# Altium schematic sheet brushless.SchDoc
size A4
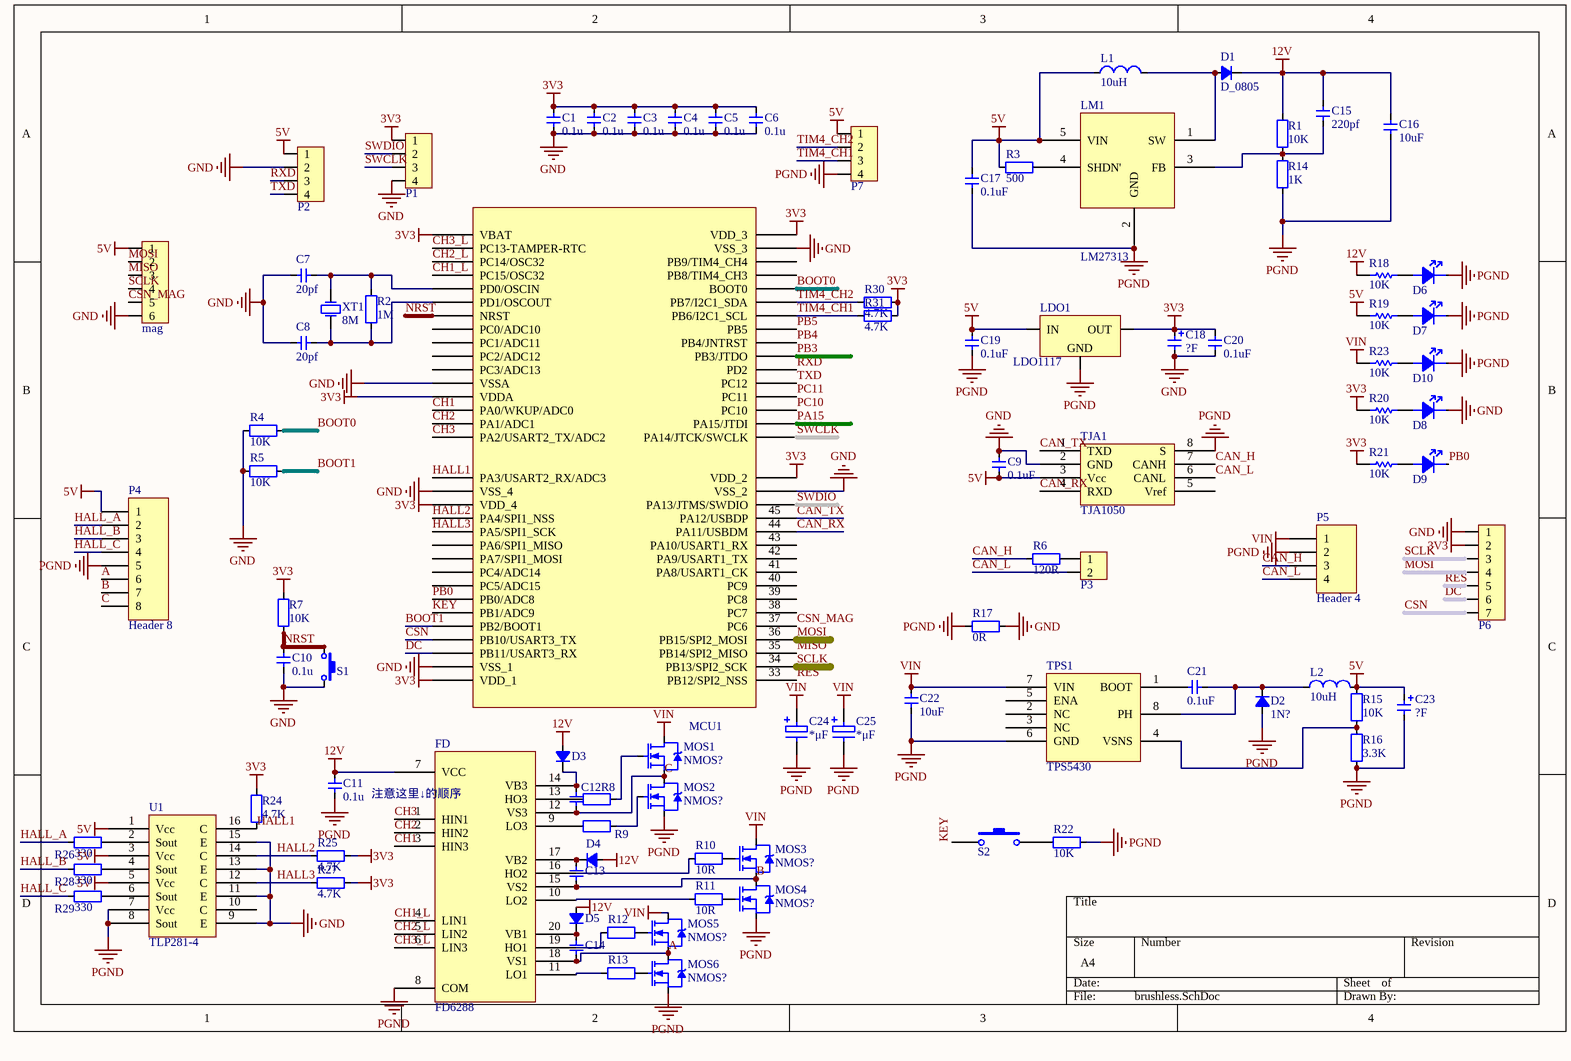
[diagram p0: brushless.SchDoc]

## Parts
C1  value 0.1u  [CAP_0603]  (hidden comment: Cap_0603)
C2  value 0.1u  [CAP_0603]  (hidden comment: Cap_0603)
C3  value 0.1u  [CAP_0603]  (hidden comment: Cap_0603)
C4  value 0.1u  [CAP_0603]  (hidden comment: Cap_0603)
C5  value 0.1u  [CAP_0603]  (hidden comment: Cap_0603)
C6  value 0.1u  [CAP_0603]  (hidden comment: Cap_0603)
C7  value 20pf  [CAP_0603]  (hidden comment: Cap_0603)
C8  value 20pf  [CAP_0603]  (hidden comment: Cap_0603)
C9  value 0.1uF  [CAP_0603]  (hidden comment: Cap_0603)
C10  value 0.1u  [CAP_0603]  (hidden comment: Cap_0603)
C11  value 0.1u  [CAP_0603]  (hidden comment: Cap_0603)
C12  Cap_0603  [CAP_0603]  (value not drawn)
C13  Cap_0603  [CAP_0603]  (value not drawn)
C14  Cap_0603  [CAP_0603]  (value not drawn)
C15  value 220pf  [CAP_0603]  (hidden comment: Cap_0603)
C16  value 10uF  [CAP_0603]  (hidden comment: Cap_0603)
C17  value 0.1uF  [CAP_0603]  (hidden comment: Cap_0603)
C18  value ?F  [CAP_TAN_D2917]  (hidden comment: Cap_Tan_2917)
C19  value 0.1uF  [CAP_0603]  (hidden comment: Cap_0603)
C20  value 0.1uF  [CAP_0603]  (hidden comment: Cap_0603)
C21  value 0.1uF  [CAP_0603]  (hidden comment: Cap_0603)
C22  value 10uF  [CAP_0603]  (hidden comment: Cap_0603)
C23  value ?F  [CAP_TAN_D2917]  (hidden comment: Cap_Tan_2917)
C24  *μF  [C_ELE2]
C25  *μF  [C_ELE2]
D1  D_0805  [LED_0805_YELLOW]
D2  value 1N?  [DO-214AC]  (hidden comment: Diode_SMA)
D3  D_0805  [LED_0805_YELLOW]  (value not drawn)
D4  D_0805  [LED_0805_YELLOW]  (value not drawn)
D5  D_0805  [LED_0805_YELLOW]  (value not drawn)
D6  lED  [0805D]  (value not drawn)
D7  lED  [0805D]  (value not drawn)
D8  lED  [0805D]  (value not drawn)
D9  lED  [0805D]  (value not drawn)
D10  lED  [0805D]  (value not drawn)
FD  FD6288  [TSSOP_E170_P0.65_20]
L1  value 10uH  [IND_CD52]  (hidden comment: Ind_CD32)
L2  value 10uH  [IND_CD52]  (hidden comment: Ind_CD32)
LDO1  LDO1117  [SOT223-3]
LM1  LM27313  [SOT23-5]
mag  HDR1x6_2.54  [HDR1X6_2.54_180]  (value not drawn)
MCU1  STM32F103RC  [LQFP_P0.5_64]  (value not drawn)
MOS1  value NMOS?  [TO-252AA]  (hidden comment: MOSFET_N)
MOS2  value NMOS?  [TO-252AA]  (hidden comment: MOSFET_N)
MOS3  value NMOS?  [TO-252AA]  (hidden comment: MOSFET_N)
MOS4  value NMOS?  [TO-252AA]  (hidden comment: MOSFET_N)
MOS5  value NMOS?  [TO-252AA]  (hidden comment: MOSFET_N)
MOS6  value NMOS?  [TO-252AA]  (hidden comment: MOSFET_N)
P1  HDR1x4_2.54  [HDR1x4_2.54_180]  (value not drawn)
P2  HDR1x4_2.54  [HDR1x4_2.54_180]  (value not drawn)
P3  HDR1x2_2.54  [HDR1X2_2.54_180]  (value not drawn)
P4  Header 8  [Green_8P]
P5  Header 4  [Green_4P]
P6  HDR1x7_2.54  [HDR1X7_2.54_180]  (value not drawn)
P7  HDR1x4_2.54  [HDR1x4_2.54_180]  (value not drawn)
R1  value 10K  [RES_0603]  (hidden comment: Res_0603)
R2  value 1M  [RES_0603]  (hidden comment: Res_0603)
R3  value 500  [RES_0603]  (hidden comment: Res_0603)
R4  value 10K  [RES_0603]  (hidden comment: Res_0603)
R5  value 10K  [RES_0603]  (hidden comment: Res_0603)
R6  value 120R  [RES_0603]  (hidden comment: Res_0603)
R7  value 10K  [RES_0603]  (hidden comment: Res_0603)
R8  Res_0603  [RES_0603]  (value not drawn)
R9  Res_0603  [RES_0603]  (value not drawn)
R10  value 10R  [RES_0603]  (hidden comment: Res_0603)
R11  value 10R  [RES_0603]  (hidden comment: Res_0603)
R12  Res_0603  [RES_0603]  (value not drawn)
R13  Res_0603  [RES_0603]  (value not drawn)
R14  value 1K  [RES_0603]  (hidden comment: Res_0603)
R15  value 10K  [RES_0603]  (hidden comment: Res_0603)
R16  value 3.3K  [RES_0603]  (hidden comment: Res_0603)
R17  value 0R  [RES_0603]  (hidden comment: Res_0603)
R18  value 10K  [RES-0603]  (hidden comment: Res1)
R19  value 10K  [RES-0603]  (hidden comment: Res1)
R20  value 10K  [RES-0603]  (hidden comment: Res1)
R21  value 10K  [RES-0603]  (hidden comment: Res1)
R22  value 10K  [RES_0603]  (hidden comment: Res_0603)
R23  value 10K  [RES-0603]  (hidden comment: Res1)
R24  value 4.7K  [RES_0603]  (hidden comment: Res_0603)
R25  value 4.7K  [RES_0603]  (hidden comment: Res_0603)
R26  value 330  [RES_0603]  (hidden comment: Res_0603)
R27  value 4.7K  [RES_0603]  (hidden comment: Res_0603)
R28  value 330  [RES_0603]  (hidden comment: Res_0603)
R29  value 330  [RES_0603]  (hidden comment: Res_0603)
R30  value 4.7K  [RES_0603]  (hidden comment: Res_0603)
R31  value 4.7K  [RES_0603]  (hidden comment: Res_0603)
S1  ButtonTACT_3x4x2_180  [ButtonTACT_3x4x2_180H]  (value not drawn)
S2  SW-PB  [key - duplicate]  (value not drawn)
TJA1  TJA1050  [SOP_E150_8]
TPS1  TPS5430  [SOP_E150_8]
U1  TLP281-4  [SOP127P700X210-16N]
XT1  value 8M  [XT_5032_2]  (hidden comment: XTAL_5032_2P)

## Nets
3V3: C1.2 C2.2 C3.2 C4.2 C5.2 C6.2 C18.1 C20.1 LDO1.2(OUT) MCU1.1(VBAT) MCU1.13(VDDA) MCU1.19(VDD_4) MCU1.32(VDD_1) MCU1.48(VDD_2) MCU1.64(VDD_3) P1.1 P6.2 R7.1 R20.2 R21.2 R24.2 R25.1 R27.1 R30.1 R31.1
5V: C9.1 C17.1 C19.1 C23.1 L1.1 L2.2 LDO1.3(IN) LM1.5(VIN) mag.1 P2.1 P4.1 P7.1 R3.2 R15.2 R19.2 TJA1.3(Vcc) U1.1(Vcc) U1.3(Vcc) U1.5(Vcc)
12V: C11.2 C15.1 C16.2 D1.2(K) D3.1(A) D4.1(A) D5.1(A) FD.7(VCC) R1.1 R18.2
GND: C1.1 C2.1 C3.1 C4.1 C5.1 C6.1 C7.1 C8.1 C9.2 C10.1 C18.2 C20.2 D8.K mag.6 MCU1.12(VSSA) MCU1.18(VSS_4) MCU1.31(VSS_1) MCU1.47(VSS_2) MCU1.63(VSS_3) P1.4 P2.2 P6.1 R4.2 R5.2 R17.1 S1.2 TJA1.2(GND) U1.9(E) U1.11(E) U1.13(E) U1.15(E)
PGND: C11.1 C16.1 C17.2 C19.2 C22.2 C23.2 C24.2 C25.2 D2.1(A) D6.K D7.K D10.K FD.8(COM) LDO1.1(GND) LM1.2(GND) MOS2.3(S) MOS4.3(S) MOS6.3(S) P4.5 P5.2 P7.4 R14.2 R16.1 R17.2 R22.2 TJA1.8(S) TPS1.6(GND) U1.7(Vcc) U1.8(Sout)
VIN: C22.1 C24.1 C25.1 MOS1.4(D) MOS3.4(D) MOS5.4(D) P5.1 R23.2 TPS1.7(VIN)
A: C14.2 FD.18(VS1) MOS5.3(S) MOS6.4(D) P4.6
B: C13.2 FD.15(VS2) MOS3.3(S) MOS4.4(D) P4.7
BOOT0: MCU1.60(BOOT0) R4.1
BOOT1: MCU1.28(PB2/BOOT1) R5.1
C: C12.2 FD.12(VS3) MOS1.3(S) MOS2.4(D) P4.8
CAN_H: P5.3 R6.2 TJA1.7(CANH)
CAN_L: P3.2 P5.4 TJA1.6(CANL)
CAN_RX: MCU1.44(PA11/USBDM) TJA1.4(RXD)
CAN_TX: MCU1.45(PA12/USBDP) TJA1.1(TXD)
CH1: FD.3(HIN3) MCU1.14(PA0/WKUP/ADC0)
CH1_L: FD.4(LIN1) MCU1.4(PC15/OSC32)
CH2: FD.2(HIN2) MCU1.15(PA1/ADC1)
CH2_L: FD.5(LIN2) MCU1.3(PC14/OSC32)
CH3: FD.1(HIN1) MCU1.16(PA2/USART2_TX/ADC2)
CH3_L: FD.6(LIN3) MCU1.2(PC13-TAMPER-RTC)
CSN: MCU1.29(PB10/USART3_TX) P6.7
CSN_MAG: mag.5 MCU1.37(PC6)
DC: MCU1.30(PB11/USART3_RX) P6.6
HALL1: MCU1.17(PA3/USART2_RX/ADC3) R24.1 U1.16(C)
HALL2: MCU1.20(PA4/SPI1_NSS) R25.2 U1.14(C)
HALL3: MCU1.21(PA5/SPI1_SCK) R27.2 U1.12(C)
HALL_A: P4.2 R26.1
HALL_B: P4.3 R28.1
HALL_C: P4.4 R29.1
KEY: MCU1.27(PB1/ADC9) S2.1
MISO: mag.3 MCU1.35(PB14/SPI2_MISO)
MOSI: mag.2 MCU1.36(PB15/SPI2_MOSI) P6.4
NRST: C10.2 MCU1.7(NRST) R7.2 S1.1
PA15: MCU1.50(PA15/JTDI)
PB0: D9.K MCU1.26(PB0/ADC8)
PB3: MCU1.55(PB3/JTDO)
PB4: MCU1.56(PB4/JNTRST)
PB5: MCU1.57(PB5)
PC10: MCU1.51(PC10)
PC11: MCU1.52(PC11)
RES: MCU1.33(PB12/SPI2_NSS) P6.5
RXD: MCU1.54(PD2) P2.3
SCLK: mag.4 MCU1.34(PB13/SPI2_SCK) P6.3
SWCLK: MCU1.49(PA14/JTCK/SWCLK) P1.3
SWDIO: MCU1.46(PA13/JTMS/SWDIO) P1.2
TIM4_CH1: MCU1.58(PB6/I2C1_SCL) P7.3 R31.2
TIM4_CH2: MCU1.59(PB7/I2C1_SDA) P7.2 R30.2
TXD: MCU1.53(PC12) P2.4
NetC7_2: C7.2 MCU1.5(PD0/OSCIN) R2.2 XT1.2(OSC2)
NetC8_2: C8.2 MCU1.6(PD1/OSCOUT) R2.1 XT1.1(OSC1)
NetC12_1: C12.1 D3.2(K) FD.14(VB3)
NetC13_1: C13.1 D4.2(K) FD.17(VB2)
NetC14_1: C14.1 D5.2(K) FD.20(VB1)
NetC15_2: C15.2 LM1.3(FB) R1.2 R14.1
NetC21_1: C21.1 D2.2(K) L2.1 TPS1.8(PH)
NetC21_2: C21.2 TPS1.1(BOOT)
NetD1_1: D1.1(A) L1.2 LM1.1(SW)
NetD6_A: D6.A R18.1
NetD7_A: D7.A R19.1
NetD8_A: D8.A R20.1
NetD9_A: D9.A R21.1
NetD10_A: D10.A R23.1
NetFD_9: FD.9(LO3) R9.1
NetFD_10: FD.10(LO2) R11.1
NetFD_11: FD.11(LO1) R13.1
NetFD_13: FD.13(HO3) R8.1
NetFD_16: FD.16(HO2) R10.1
NetFD_19: FD.19(HO1) R12.1
NetLM1_4: LM1.4(SHDN') R3.1
NetMOS1_1: MOS1.1(G) R8.2
NetMOS2_1: MOS2.1(G) R9.2
NetMOS3_1: MOS3.1(G) R10.2
NetMOS4_1: MOS4.1(G) R11.2
NetMOS5_1: MOS5.1(G) R12.2
NetMOS6_1: MOS6.1(G) R13.2
NetP3_1: P3.1 R6.1
NetR15_1: R15.1 R16.2 TPS1.4(VSNS)
NetR22_1: R22.1 S2.2
NetR26_2: R26.2 U1.2(Sout)
NetR28_2: R28.2 U1.4(Sout)
NetR29_2: R29.2 U1.6(Sout)

Not connected (* = marked no-connect by the designer): MCU1 8(PC0/ADC10) 9(PC1/ADC11) 10(PC2/ADC12) 11(PC3/ADC13) 22(PA6/SPI1_MISO) 23(PA7/SPI1_MOSI) 24(PC4/ADC14) 25(PC5/ADC15) 38(PC7) 39(PC8) 40(PC9) 41(PA8/USART1_CK) 42(PA9/USART1_TX) 43(PA10/USART1_RX) 61(PB8/TIM4_CH3) 62(PB9/TIM4_CH4); TJA1 5(Vref); TPS1 2(NC) 3(NC) 5(ENA); U1 10(C)

## Notes on the sheet
- (near FD) 注意这里↓的顺序

## Library data of the parts
C1-C11 C15-C17 C19-C22 = Cap_0603: Capacitor
C12-C14 = Cap_0603: Capacitor; Value: 0.1u
C18 C23 = Cap_Tan_2917: Capacitor
C24 C25 = CAP-ELE: 电解电容; Published: 8-Jun-2000; LatestRevisionDate: 17-Jul-2002; LatestRevisionNote: Re-released for DXP Platform.; PackageReference: RB7.6-15; Publisher: Altium Limited; PackageDescription: Polarized Capacitor (Radial); 2 Leads; Value: *μF
D2 = Diode_SMA: Diode
D6-D10 = 00-D-LED
L1 L2 = Ind_CD32: Inductor
LDO1 = LDO1117: Power
mag = HDR1x6_2.54: Header
MCU1 = STM32F103RC: MCU
MOS1-MOS6 = MOSFET_N: MOSFET
P1 P2 P7 = HDR1x4_2.54: Header
P3 = HDR1x2_2.54: Header
P4 = Header 8: Header, 8-Pin; LatestRevisionDate: 17-Jul-2002; LatestRevisionNote: Re-released for DXP Platform.; Publisher: Altium Limited
P5 = Header 4: Header, 4-Pin; LatestRevisionDate: 17-Jul-2002; LatestRevisionNote: Re-released for DXP Platform.; Publisher: Altium Limited
P6 = HDR1x7_2.54T: Header
R1-R7 R10 R11 R14-R17 R22 R24-R31 = Res_0603: Resistor
R8 R9 R12 R13 = Res_0603: Resistor; Value: 10R
R18-R21 R23 = Res1_1: Resistor; Published: 8-Jun-2000; LatestRevisionDate: 17-Jul-2002; LatestRevisionNote: Re-released for DXP Platform.; PackageReference: AXIAL-0.3; Publisher: Altium Limited
S1 = ButtonTACT_3x4x2_180: Button
S2 = SW-PB: Switch; Published: 24-Mar-1999; LatestRevisionDate: 17-Jul-2002; LatestRevisionNote: Re-released for DXP Platform.; PackageReference: SPST-2; Publisher: Altium Limited; PackageDescription: Switch; 2 Leads
U1 = IC-TLP281-4
XT1 = XTAL_5032_2P: Crystal Oscillator